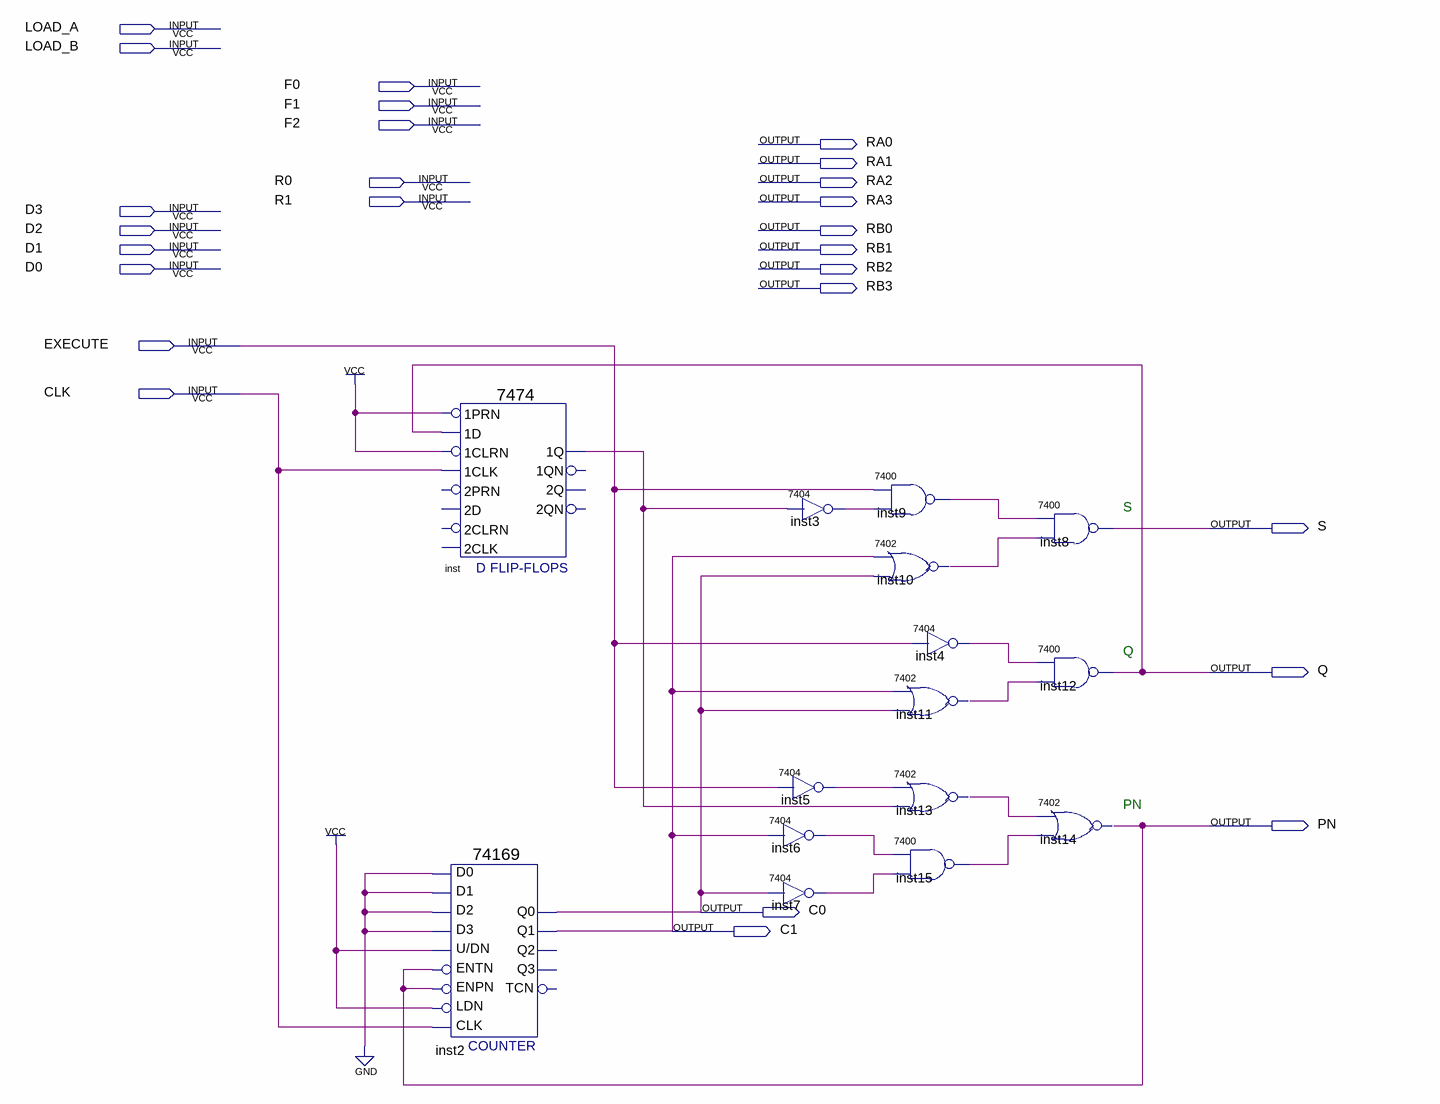
[diagram p0: schematic sheet]
// Quartus schematic lab3 part.bdf as structural Verilog: 15 symbols, 26 pins
module \lab3_part  (
  input  LOAD_A,
  input  LOAD_B,
  input  F0,
  input  F1,
  input  F2,
  input  R0,
  input  R1,
  input  D3,
  input  D2,
  input  D1,
  input  D0,
  input  EXECUTE,
  input  CLK,
  output RA0,
  output RA1,
  output RA2,
  output RA3,
  output RB0,
  output RB1,
  output RB2,
  output RB3,
  output S,
  output Q,
  output PN,
  output C0,
  output C1
);

  wire inst3_1, inst4_1, inst5_1, inst6_1, inst7_1, inst9_1, inst10_1, inst11_1, inst13_1, inst15_1, inst_1q;

  \7474  inst (
    .\1CLK (CLK), .\1D (Q), .\1PRN (1'b1), .\1CLRN (1'b1), .\1Q (inst_1q));  // open: 2D, 2PRN, 2CLK, 2CLRN, 1QN, 2Q, 2QN
  \74169  inst2 (
    .D1(1'b0), .D2(1'b0), .D0(1'b0), .ENTN(PN), .\U/DN (1'b1), .D3(1'b0), .LDN(1'b1), .CLK(CLK), .ENPN(PN),
    .Q1(C1), .Q0(C0));  // open: Q2, TCN, Q3
  \7404  inst3 (.\2 (inst_1q), .\1 (inst3_1));
  \7404  inst5 (.\2 (EXECUTE), .\1 (inst5_1));
  \7404  inst6 (.\2 (C1), .\1 (inst6_1));
  \7404  inst7 (.\2 (C0), .\1 (inst7_1));
  \7400  inst9 (.\3 (inst3_1), .\2 (EXECUTE), .\1 (inst9_1));
  \7402  inst10 (.\2 (C1), .\3 (C0), .\1 (inst10_1));
  \7404  inst4 (.\2 (EXECUTE), .\1 (inst4_1));
  \7402  inst11 (.\2 (C1), .\3 (C0), .\1 (inst11_1));
  \7402  inst13 (.\2 (inst5_1), .\3 (inst_1q), .\1 (inst13_1));
  \7400  inst15 (.\3 (inst7_1), .\2 (inst6_1), .\1 (inst15_1));
  \7400  inst8 (.\3 (inst10_1), .\2 (inst9_1), .\1 (S));
  \7400  inst12 (.\3 (inst11_1), .\2 (inst4_1), .\1 (Q));
  \7402  inst14 (.\2 (inst13_1), .\3 (inst15_1), .\1 (PN));

  // Notes on the sheet:
  //   S
  //   Q
  //   PN
endmodule
